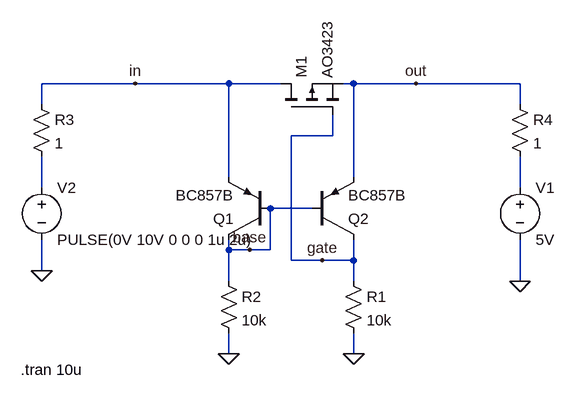
[diagram p0: schematic ideal diode.asc]
ideal diode.asc, the LTspice schematic file:
Version 4
SHEET 1 880 680
WIRE 0 -48 -144 -48
WIRE 144 -48 0 -48
WIRE 224 -48 144 -48
WIRE 336 -48 320 -48
WIRE 432 -48 336 -48
WIRE 592 -48 432 -48
WIRE -144 -16 -144 -48
WIRE 592 -16 592 -48
WIRE 304 32 304 0
WIRE 304 32 240 32
WIRE 144 96 144 -48
WIRE 336 96 336 -48
WIRE -144 112 -144 64
WIRE 592 112 592 64
WIRE 272 144 208 144
WIRE 144 208 144 192
WIRE 176 208 144 208
WIRE 208 208 208 144
WIRE 208 208 176 208
WIRE 240 224 240 32
WIRE 288 224 240 224
WIRE 336 224 336 192
WIRE 336 224 288 224
WIRE -144 240 -144 192
WIRE 144 256 144 208
WIRE 336 256 336 224
WIRE 592 256 592 192
WIRE 144 368 144 336
WIRE 336 368 336 336
FLAG 144 368 0
FLAG 336 368 0
FLAG 592 256 0
FLAG -144 240 0
FLAG 0 -48 in
FLAG 432 -48 out
FLAG 176 208 base
FLAG 288 224 gate
SYMBOL pnp 208 192 R180
SYMATTR InstName Q1
SYMATTR Value BC857B
SYMBOL pnp 272 192 M180
SYMATTR InstName Q2
SYMATTR Value BC857B
SYMBOL pmos 224 0 R270
SYMATTR InstName M1
SYMATTR Value AO3423
SYMBOL res 320 240 R0
SYMATTR InstName R1
SYMATTR Value 10k
SYMBOL res 128 240 R0
SYMATTR InstName R2
SYMATTR Value 10k
SYMBOL voltage 592 96 R0
WINDOW 123 0 0 Left 0
WINDOW 39 0 0 Left 0
SYMATTR InstName V1
SYMATTR Value 5V
SYMBOL voltage -144 96 R0
WINDOW 123 0 0 Left 0
WINDOW 39 0 0 Left 0
SYMATTR InstName V2
SYMATTR Value PULSE(0V 10V 0 0 0 1u 2u)
SYMBOL res -160 -32 R0
SYMATTR InstName R3
SYMATTR Value 1
SYMBOL res 576 -32 R0
SYMATTR InstName R4
SYMATTR Value 1
TEXT -176 392 Left 2 !.tran 10u

The netlist it stands for:
* ideal diode.asc
Q1 base base in 0 BC857B
Q2 gate base out 0 BC857B
M1 in gate out out AO3423
R1 gate 0 10k
R2 base 0 10k
V1 N002 0 5V
V2 N001 0 PULSE(0V 10V 0 0 0 1u 2u)
R3 in N001 1
R4 out N002 1
.model NPN NPN
.model PNP PNP
.lib standard.bjt
.model NMOS NMOS
.model PMOS PMOS
.lib standard.mos
.tran 10u
.backanno
.end